# EAGLE design Power Distribution_V2 (EAGLE 9.6.2)
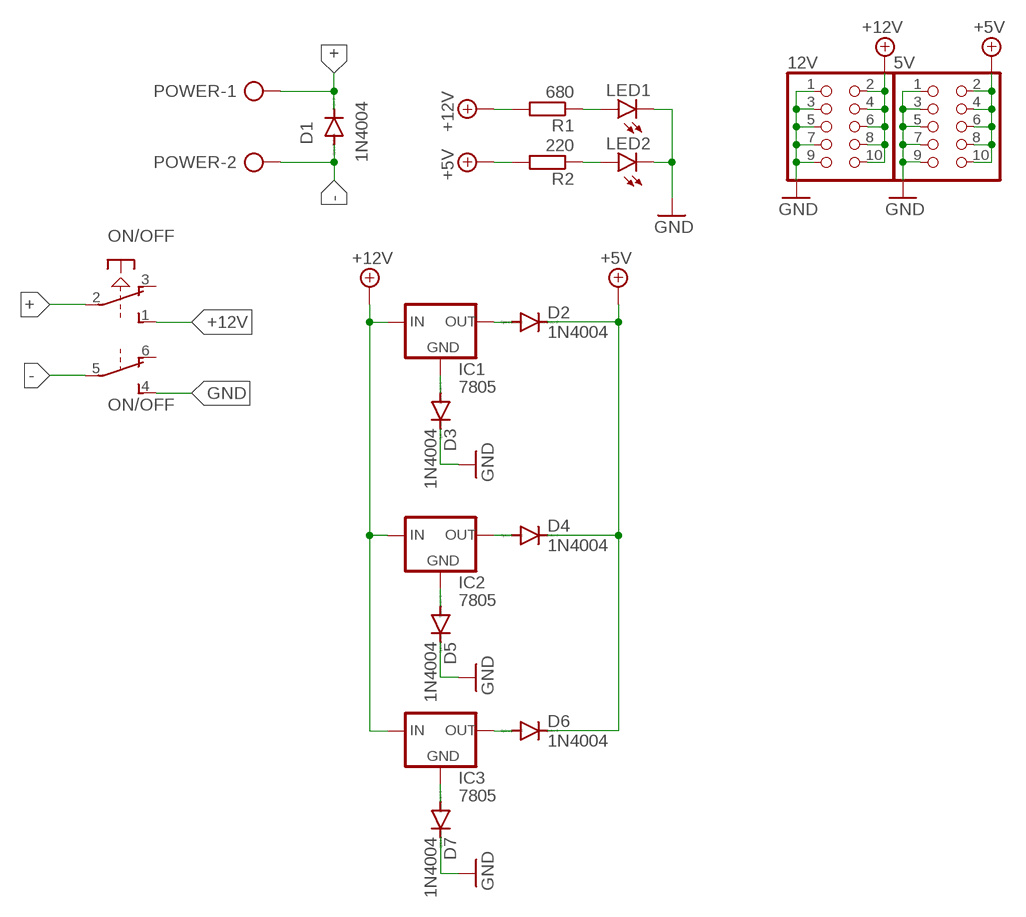
[diagram p0: schematic, sheet 1]

## Parts
5V  PINHD-2X5  [2X05]
12V  PINHD-2X5  [2X05]
D1  1N4004  [DO41-10]
D2  1N4004  [DO41-10]
D3  1N4004  [DO41-10]
D4  1N4004  [DO41-10]
D5  1N4004  [DO41-10]
D6  1N4004  [DO41-10]
D7  1N4004  [DO41-10]
IC1  7805  78XXS  [78XXS]
IC2  7805  78XXS  [78XXS]
IC3  7805  78XXS  [78XXS]
LED1  LED3MM  [LED3MM]
LED2  LED3MM  [LED3MM]
ON/OFF  PVA2R  [PVA2R]
POWER  AK500/2-H  [AK500/2-H]
R1  680  R-EU_0207/10  [0207/10]
R2  220  R-EU_0207/10  [0207/10]

## Nets
+: D1.C ON/OFF.2(1:P) POWER.1
+5V: 5V.2 5V.4 5V.6 5V.8 5V.10 D2.C D4.C D6.C R2.2
+12V: 12V.2 12V.4 12V.6 12V.8 12V.10 IC1.IN IC2.IN IC3.IN ON/OFF.1(1:S) R1.2
-: D1.A ON/OFF.5(2:P) POWER.2
GND: 5V.1 5V.3 5V.5 5V.7 5V.9 12V.1 12V.3 12V.5 12V.7 12V.9 D3.C D5.C D7.C LED1.K(C) LED2.K(C) ON/OFF.4(2:S)
N$3: LED1.A R1.1
N$4: D7.A IC3.GND
N$5: LED2.A R2.1
N$6: D5.A IC2.GND
N$7: D3.A IC1.GND
N$8: D2.A IC1.OUT
N$9: D6.A IC3.OUT
N$10: D4.A IC2.OUT
Unconnected: ON/OFF.3(1:O) ON/OFF.6(2:O)

## Library data of the parts
5V 12V = pinhead:PINHD-2X5: PIN HEADER
D1-D7 = diode:1N4004: DIODE general purpose rectifier, 1 A
IC1-IC3 = v-reg:78XXS: VOLTAGE REGULATOR
LED1 LED2 = led:LED: LED OSRAM: - CHIPLED LG R971, LG N971, LY N971, LG Q971, LY Q971, LO R971, LY R971 LH N974, LH R974 LS Q976, LO Q976, LY Q976 LO Q996 - Hyper CHIPLED LW Q18S LB Q993, LB Q99A, LB R99A - SideLED LS A670, LO A670, LY A670, LG A670, LP A670 LB A673, LV A673, LT A673, LW A673 LH A674 LY A675 LS A676, LA A676, LO A676, LY A676, LW A676 LS A679, LY A679, LG A679 - Hyper Micro SIDELED® LS Y876, LA Y876, LO Y876, LY Y876 LT Y87S - SmartLED LW L88C, LW L88S LB L89C, LB L89S, LG L890 LS L89K, LO L89K, LY L89K LS L896, LA L896, LO L896, LY L896 - TOPLED LS T670, LO T670, LY T670, LG T670, LP T670 LSG T670, LSP T670, LSY T670, LOP T670, LYG T670 LG T671, LOG T671, LSG T671 LB T673, LV T673, LT T673, LW T673 LH T674 LS T676, LA T676, LO T676, LY T676, LB T676, LH T676, LSB T676, LW T676 LB T67C, LV T67C, LT T67C, LS T67K, LO T67K, LY T67K, LW E67C LS E67B, LA E67B, LO E67B, LY E67B, LB E67C, LV E67C, LT E67C LW T67C LS T679, LY T679, LG T679 LS T770, LO T770, LY T770, LG T770, LP T770 LB T773, LV T773, LT T773, LW T773 LH T774 LS E675, LA E675, LY E675, LS T675 LS T776, LA T776, LO T776, LY T776, LB T776 LHGB T686 LT T68C, LB T68C - Hyper Mini TOPLED® LB M676 - Mini TOPLED Santana® LG M470 LS M47K, LO M47K, LY M47K Source: http://www.osram.convergy.de LUXEON: - LUMILED® LXK2-PW12-R00, LXK2-PW12-S00, LXK2-PW14-U00, LXK2-PW14-V00 LXK2-PM12-R00, LXK2-PM12-S00, LXK2-PM14-U00 LXK2-PE12-Q00, LXK2-PE12-R00, LXK2-PE12-S00, LXK2-PE14-T00, LXK2-PE14-U00 LXK2-PB12-K00, LXK2-PB12-L00, LXK2-PB12-M00, LXK2-PB14-N00, LXK2-PB14-P00, LXK2-PB14-Q00 LXK2-PR12-L00, LXK2-PR12-M00, LXK2-PR14-Q00, LXK2-PR14-R00 LXK2-PD12-Q00, LXK2-PD12-R00, LXK2-PD12-S00 LXK2-PH12-R00, LXK2-PH12-S00 LXK2-PL12-P00, LXK2-PL12-Q00, LXK2-PL12-R00 Source: www.luxeon.com KINGBRIGHT: KA-3528ASYC Source: www.kingbright.com
ON/OFF = switch-misc:PVA2R: ITT SWITCH
POWER = con-ptr500:AK500/2-H: CONNECTOR Aug. 2004 / PTR Meßtechnik: Die Bezeichnung der Serie AK505 wurde geändert. Es handelt sich hierbei um AK500 in horizontaler Ausführung.; OC_FARNELL: unknown; OC_NEWARK: unknown
R1 R2 = rcl:R-EU_: RESISTOR, European symbol; SPICEPREFIX: R

## Board
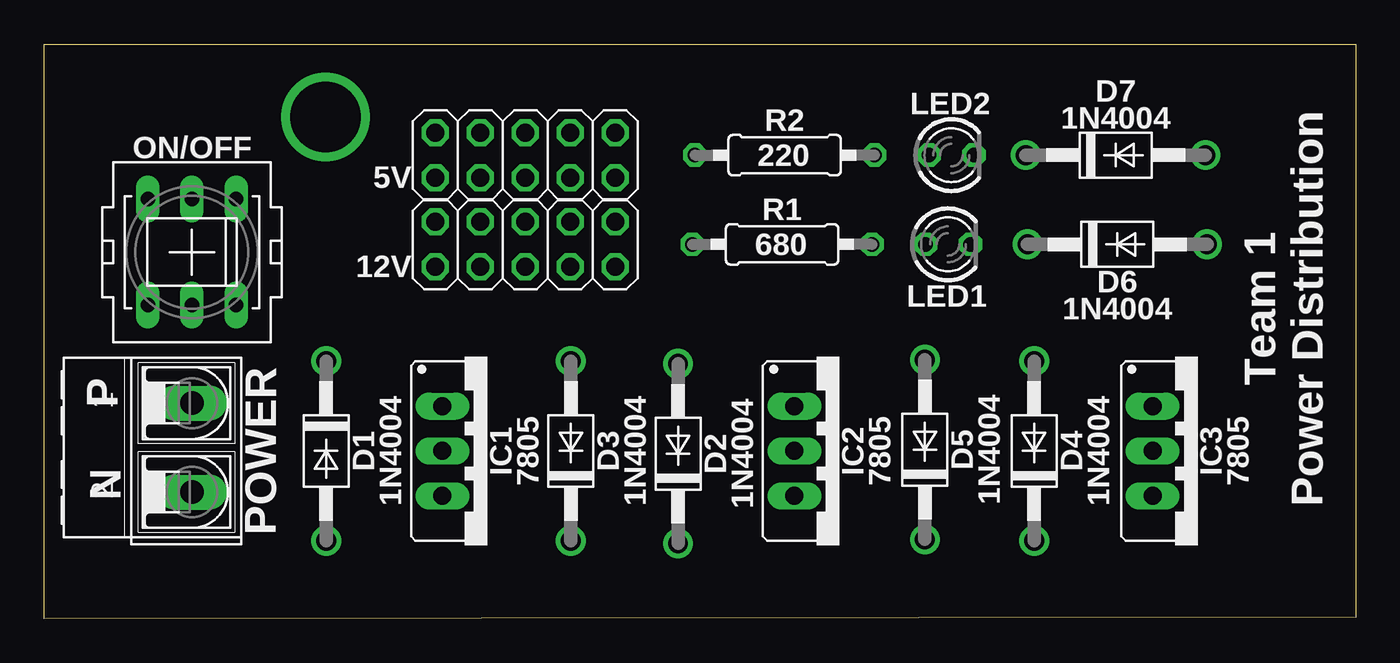
[diagram p1: board, top side]
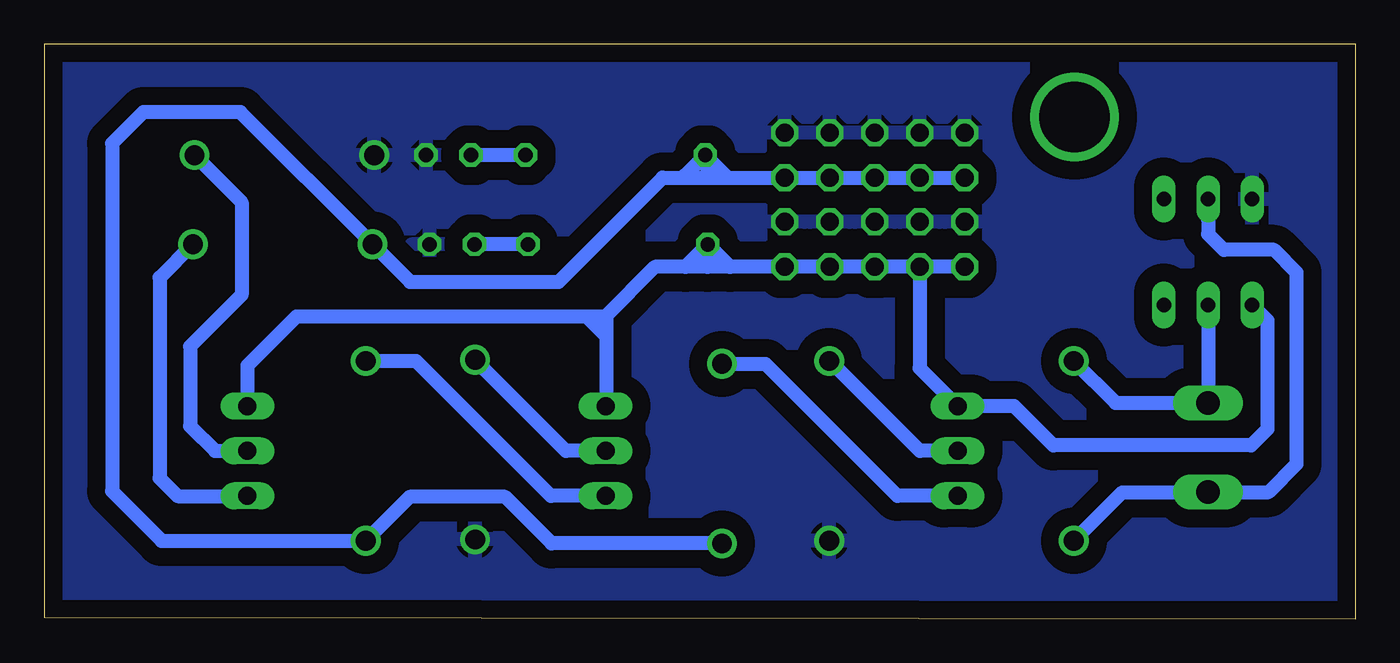
[diagram p2: board, bottom side, seen from below]

Size 74.17 x 32.49 mm. Coordinates in mm from the lower left corner, seen from the top.
Outline: 0,32.49 74.17,32.49 74.17,0.08 0,0 0,32.49
Copper layers (1*16): Top 0.035mm / dielectric 1.5mm / Bottom 0.035mm
Design rules "default *": minimum track width 0.8mm, minimum drill 0.7mm, track to track 0.6mm, track to pad 0.6mm, pad to pad 0.6mm, via to via 0.6mm, smd to smd 6mil, copper to edge 40mil, drill to drill 6mil, minimum pad ring 10mil, minimum via ring 8mil, stop-mask expansion 4mil, vias tented up to drill 0mil, thermal gap 10mil

### Footprints (pad centres in the part's own frame; a part is rotated, then mirrored left to right if it is on the bottom)
2X05 = drill 1.016 octagon: 1 -5.08,-1.27; 2 -5.08,1.27; 3 -2.54,-1.27; 4 -2.54,1.27; 5 0,-1.27; 6 0,1.27; 7 2.54,-1.27; 8 2.54,1.27; 9 5.08,-1.27; 10 5.08,1.27
DO41-10 = drill 1.118: A 5.08,0; C -5.08,0
78XXS = drill 1.016 long: GND 0,-2.54; IN -2.54,-2.54; OUT 2.54,-2.54
LED3MM = drill 0.813 octagon: A -1.27,0; K 1.27,0
PVA2R = drill 0.813 long: 1 -2.997,2.489; 2 -2.997,0; 3 -2.997,-2.489; 4 2.997,2.489; 5 2.997,0; 6 2.997,-2.489
AK500/2-H = drill 1.321 long: 1 -2.515,0; 2 2.515,0
0207/10 = drill 0.813 octagon: 1 -5.08,0; 2 5.08,0

### Placement (x,y rotation side)
5V  27.2,26.21 180 top
12V  27.2,21.17 180 top
D1  15.95,9.49 270 top
D2  35.84,9.33 90 top
D3  29.78,9.49 90 top
D4  55.98,9.49 90 top
D5  49.8,9.56 90 top
D6  60.68,21.17 0 top
D7  60.59,26.21 0 top
IC1  25.06,9.49 270 top
IC2  44.96,9.49 270 top
IC3  65.22,9.49 270 top
LED1  51.11,21.17 0 top
LED2  51.3,26.21 0 top
ON/OFF  8.36,20.73 90 top
POWER  8.36,9.68 270 top
R1  41.73,21.17 180 top
R2  41.87,26.21 180 top

### Tracks (layer width: path | path; a pad name or v marks a point on that pad's centre or on a via)
+
  Bottom 0.8: D1.C 13.58,12.21 POWER.1 ON/OFF.2
+5V
  Bottom 0.8: D2.C 45.48,4.25 48.11,6.88 53.51,6.88 D4.C 67.53,4.41 70.33,7.21 70.33,26.87 68.56,28.65 63.08,28.65 D6.C 53.48,19.05 45.09,19.05 39.19,24.94 37.95,24.94 | R2.2 35.52,24.94 | 35.52,24.94 5V.2 5V.4 5V.6 25.22,24.94 | 25.22,24.94 | 25.22,24.94 5V.8 | 5V.8 | 5V.8 5V.10 | 37.95,24.94 36.68,24.94 | 36.68,24.94 35.52,24.94 | R2.2 36.68,26.1 36.68,24.94 | R2.2 37.95,25.05 37.95,24.94
+12V
  Bottom 0.8: ON/OFF.1 5,16.87 5,10.72 5.92,9.8 17.09,9.8 19.32,12.03 IC1.IN 24.66,14.17 12V.8 | 12V.10 12V.8 | 12V.8 12V.6 12V.4 12V.2 35.38,19.9 | 36.65,19.9 37.92,19.9 | 37.92,19.9 39.64,19.9 42.39,17.15 | 36.65,19.9 R1.2 | 42.39,17.15 42.39,15.98 | 42.39,15.98 42.39,12.15 42.42,12.13 IC2.IN | IC3.IN 62.68,14.31 59.89,17.09 43.51,17.09 | 42.39,17.15 42.44,17.09 43.51,17.09 | 35.38,19.9 36.65,19.9 | R1.2 35.38,19.9 | R1.2 37.92,19.9 | 43.51,17.09 42.39,15.98
-
  Bottom 0.8: D1.A 13.2,7.15 8.37,7.15 POWER.2 4.93,7.16 3.35,8.74 3.35,19.58 4.62,20.85 7.46,20.85 8.36,21.75 ON/OFF.5 8.36,22.58
GND
  pour Bottom (isolate 1.016): -4.39,35.38 77.37,35.38 77.37,-2.26 -4.39,-2.26
N$1  (via drill 4)
  other vias: 15.9,28.37
N$3
  Bottom 0.8: R1.1 | R1.1 | R1.1 LED1.A
N$4
  Bottom 0.8: D7.A 63,23.55 63,18.31 65.91,15.4 65.91,10.9 64.5,9.49 IC3.GND
N$5
  Bottom 0.8: R2.1 LED2.A | LED2.A
N$6
  Bottom 0.8: IC2.GND 44.67,9.49 49.8,14.62 D5.A
N$7
  Bottom 0.8: D3.A 29.73,14.57 24.65,9.49 IC1.GND
N$8
  Bottom 0.8: IC1.OUT 25.92,6.95 33.39,14.41 D2.A
N$9
  Bottom 0.8: IC3.OUT 62.69,6.93 66.62,6.93 67.64,7.95 67.64,19.29 D6.A
N$10
  Bottom 0.8: IC2.OUT 45.52,6.95 53.14,14.57 D4.A

### Text on the board
tPlace: Team 1 / Power Distribution | P | N